# Altium schematic sheet нижняя плата версия 4.SchDoc
size 594 x 420 mm; Author: ALTIUM GOSTBOM2.0 KEV; SheetNumber: 1; SheetTotal: 1; Обозначение_Код: НАПК0001.00.02Р; Наименование2: Модуль питания; п_Разраб_Р: Хейфец С.С.; п_Пров_Р: Хрущев А.С.; п_Утв_Р: Хейфец С.С.; Вид_документа_SCH: Схема принципиальная; Наименование_организации: Неясыти Аэро
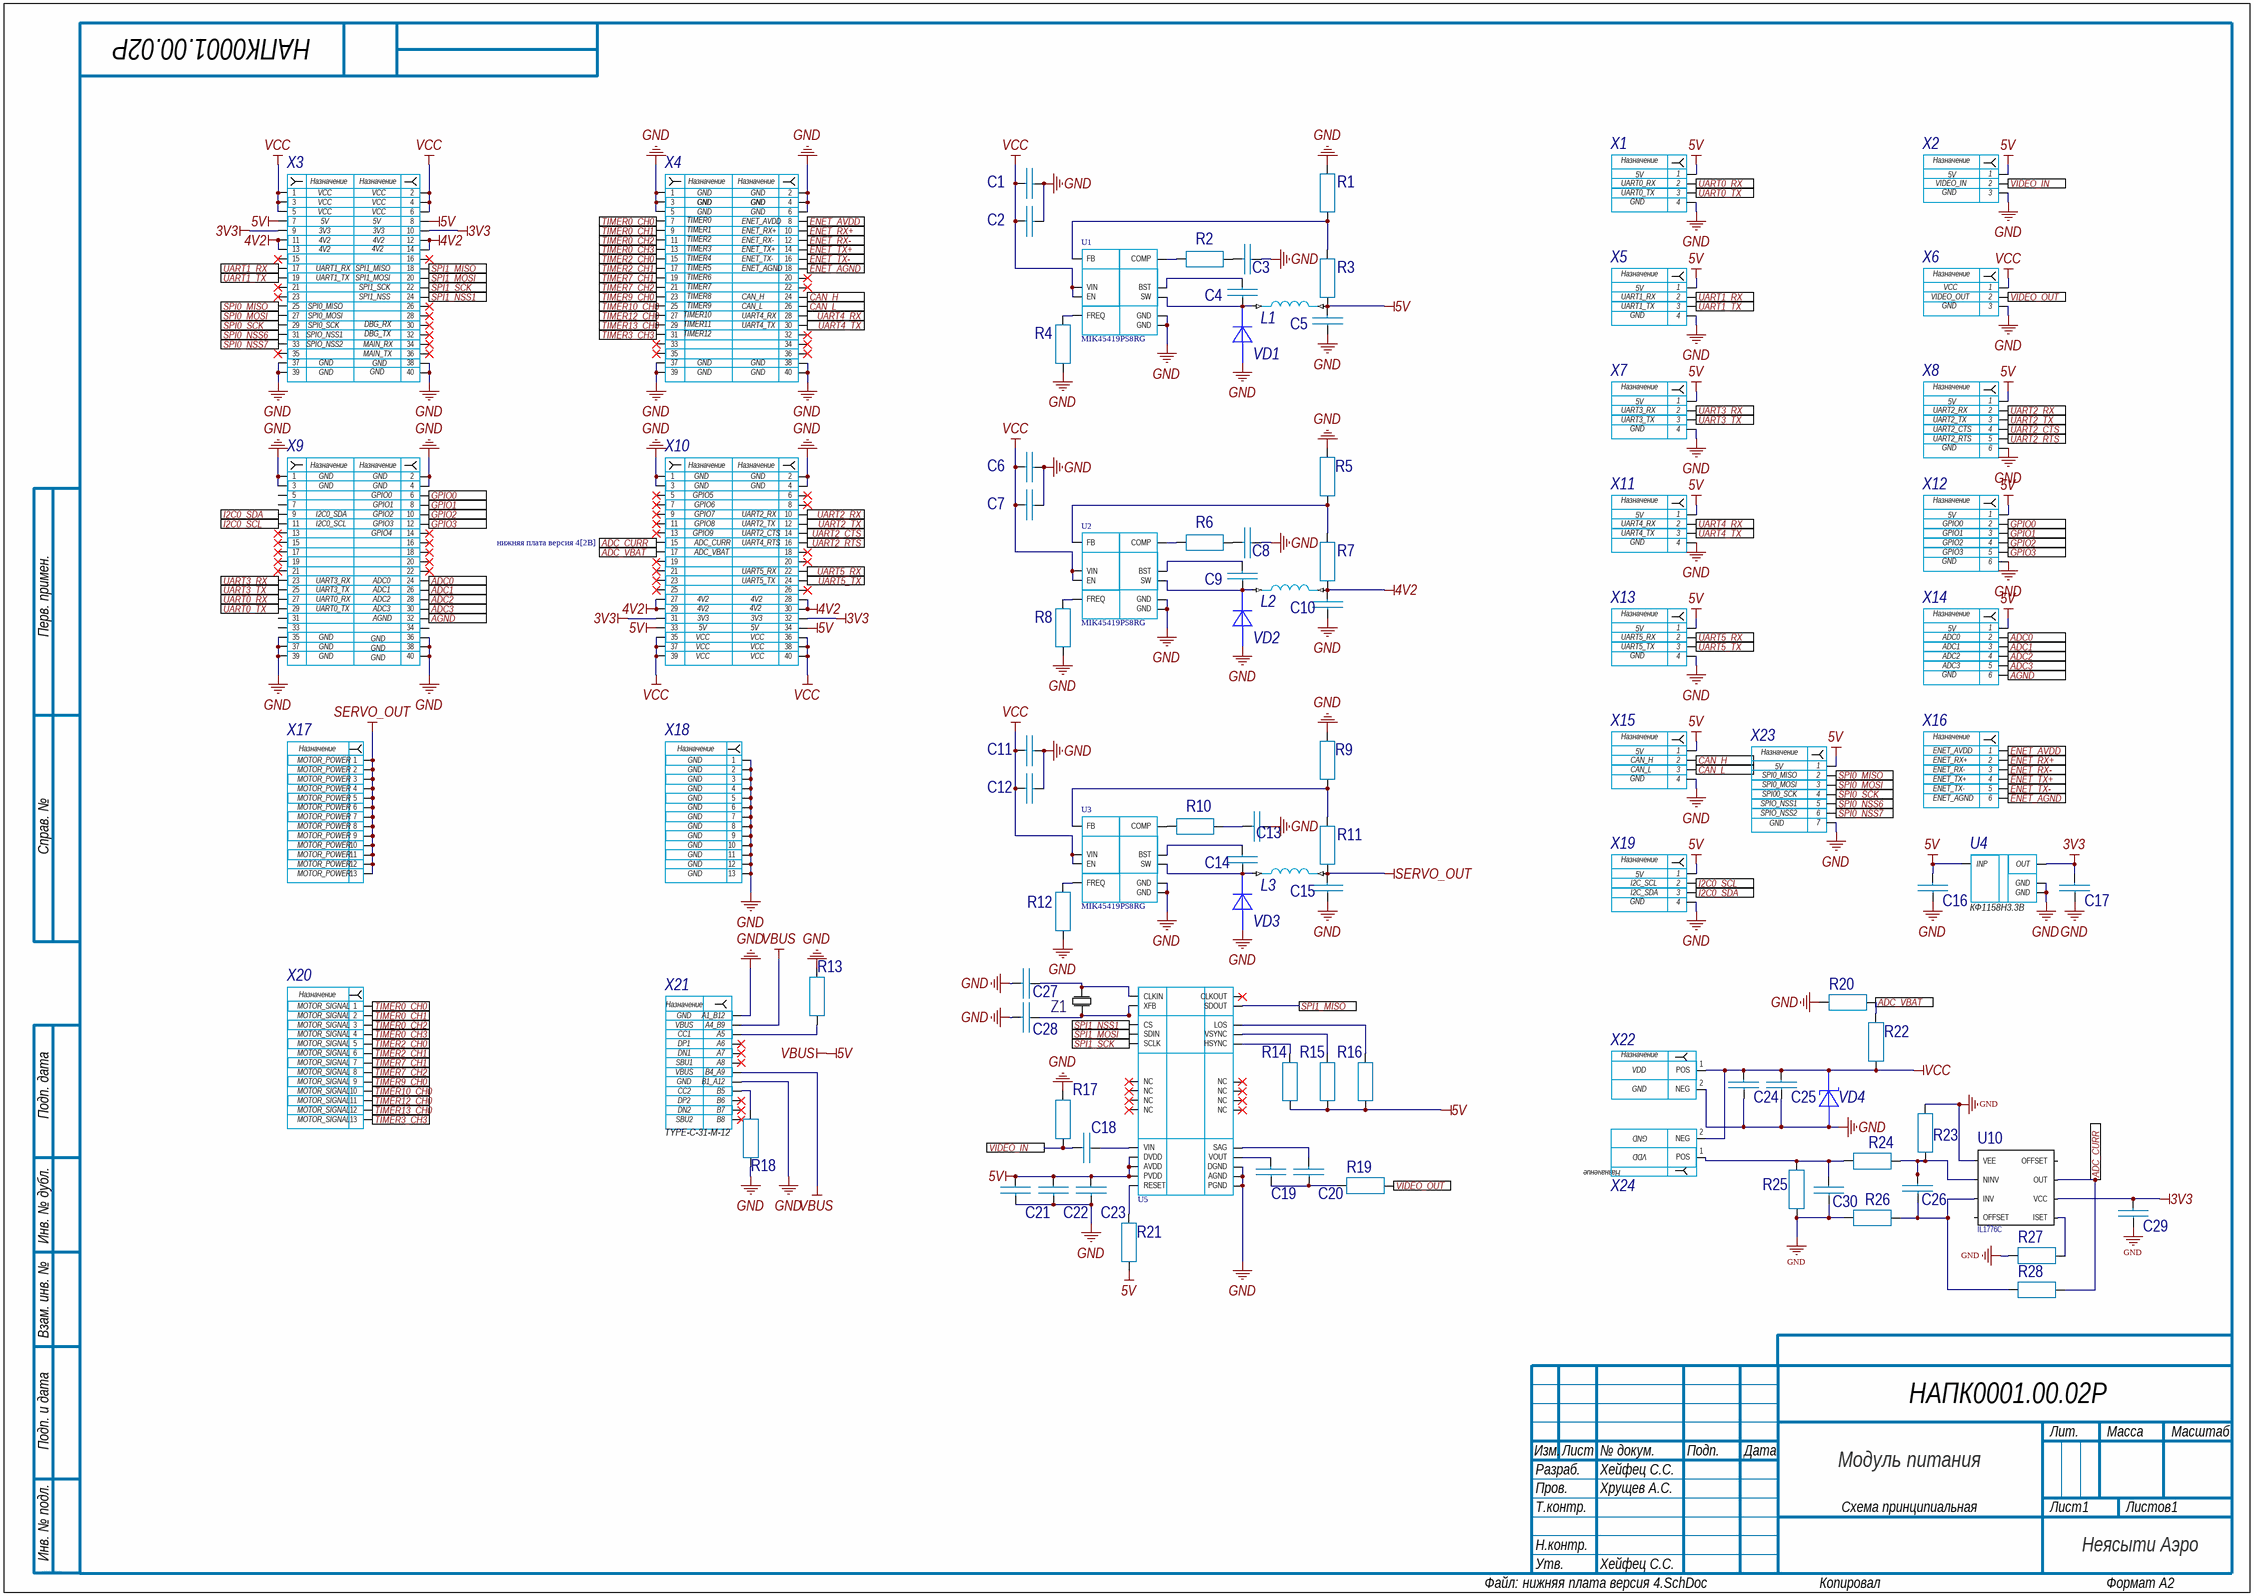
[diagram p0: нижняя плата версия 4.SchDoc]

## Parts
C1  4u7  [C1206]  (value not drawn)
C2  100n  [C0603]  (value not drawn)
C3  220p  [C0603]  (value not drawn)
C4  100n  [C0603]  (value not drawn)
C5  22u  [C0603]  (value not drawn)
C6  4u7  [C1206]  (value not drawn)
C7  100n  [C0603]  (value not drawn)
C8  220p  [C0603]  (value not drawn)
C9  100n  [C0603]  (value not drawn)
C10  22u  [C0603]  (value not drawn)
C11  4u7  [C1206]  (value not drawn)
C12  100n  [C0603]  (value not drawn)
C13  220p  [C0603]  (value not drawn)
C14  100n  [C0603]  (value not drawn)
C15  22u  [C1206]  (value not drawn)
C16  (no value)  [C0603]
C17  (no value)  [C0603]
C18  (no value)  [C0603]
C19  22u  [C1206]  (value not drawn)
C20  22u  [C1206]  (value not drawn)
C21  100n  [C0603]  (value not drawn)
C22  100n  [C0603]  (value not drawn)
C23  100n  [C0603]  (value not drawn)
C24  22u  [C1206]  (value not drawn)
C25  22u  [C1206]  (value not drawn)
C26  100n  [C0603]  (value not drawn)
C27  100n  [C0603]  (value not drawn)
C28  100n  [C0603]  (value not drawn)
C29  22u  [C1206]  (value not drawn)
C30  100n  [C0603]  (value not drawn)
L1  4u7  [МИ-3]  (value not drawn)
L2  4u7  [МИ-3]  (value not drawn)
L3  4u7  [МИ-3]  (value not drawn)
R1  23K7  [R0603]  (value not drawn)
R2  133K  [R0603]  (value not drawn)
R3  124K  [R0603]  (value not drawn)
R4  57K6  [R0603]  (value not drawn)
R5  29K4  [R0603]  (value not drawn)
R6  113K  [R0603]  (value not drawn)
R7  124K  [R0603]  (value not drawn)
R8  57.6  [R0603]  (value not drawn)
R9  23K7  [R0603]  (value not drawn)
R10  113K  [R0603]  (value not drawn)
R11  124K  [R0603]  (value not drawn)
R12  57.6  [R0603]  (value not drawn)
R13  (no value)  [R0603]
R14  1K  [R0603]  (value not drawn)
R15  1K  [R0603]  (value not drawn)
R16  1K  [R0603]  (value not drawn)
R17  75  [R0603]  (value not drawn)
R18  (no value)  [R0603]
R19  75  [R0603]  (value not drawn)
R20  10K  [R0603]  (value not drawn)
R21  10K  [R0603]  (value not drawn)
R22  100K  [R0603]  (value not drawn)
R23  1K  [R0603]  (value not drawn)
R24  1K  [R0603]  (value not drawn)
R25  0R001  [RESC6864X114N]  (value not drawn)
R26  1K  [R0603]  (value not drawn)
R27  1K  [R0603]  (value not drawn)
R28  1K  [R0603]  (value not drawn)
U1  MIK45419PS8RG  [SOIC127P600X170-9N]
U2  MIK45419PS8RG  [SOIC127P600X170-9N]
U3  MIK45419PS8RG  [SOIC127P600X170-9N]
U4  КФ1158Н3.3В  [SOT-428]
U5  AT7456  [at7456]  (value not drawn)
U10  IL1776C  [SOIC-8]
VD1  SS3P4  [DO-214AC]  (value not drawn)
VD2  SS3P4  [DO-214AC]  (value not drawn)
VD3  SS3P4  [DO-214AC]  (value not drawn)
VD4  (no value)  [DO-214AA]
X1  Molex Picoblade 0532610471  [PicoBlade 4pin]  (value not drawn)
X2  Molex Picoblade 0532610371  [PicoBlade 3pin]  (value not drawn)
X3  PLLD-1.27-40S  [Headr 2x20 male]  (value not drawn)
X4  PLLD-1.27-40S  [Headr 2x20 male]  (value not drawn)
X5  Molex Picoblade 0532610471  [PicoBlade 4pin]  (value not drawn)
X6  Molex Picoblade 0532610371  [PicoBlade 3pin]  (value not drawn)
X7  Molex Picoblade 0532610471  [PicoBlade 4pin]  (value not drawn)
X8  Molex Picoblade 0532610671  [PicoBlade 6pin]  (value not drawn)
X9  PLLD-1.27-40S  [Headr 2x20 male]  (value not drawn)
X10  PLLD-1.27-40S  [Headr 2x20 male]  (value not drawn)
X11  Molex Picoblade 0532610471  [PicoBlade 4pin]  (value not drawn)
X12  Molex Picoblade 0532610671  [PicoBlade 6pin]  (value not drawn)
X13  Molex Picoblade 0532610471  [PicoBlade 4pin]  (value not drawn)
X14  Molex Picoblade 0532610671  [PicoBlade 6pin]  (value not drawn)
X15  Molex Picoblade 0532610471  [PicoBlade 4pin]  (value not drawn)
X16  Molex Picoblade 0532610671  [PicoBlade 6pin]  (value not drawn)
X17  (no value)  [SERV]
X18  (no value)  [SERV]
X19  Molex Picoblade 0532610471  [PicoBlade 4pin]  (value not drawn)
X20  (no value)  [SERV]
X21  TYPE-C-31-M-12  [HRO_TYPE-C-31-M-12]
X22  Amass XT-60-PW-M  [AMASS_XT60PW-M]  (value not drawn)
X23  Molex Picoblade 0532610771  [PicoBlade 7pin]  (value not drawn)
X24  Amass XT-60-PW-F  [AMASS_XT60PW-F]  (value not drawn)
Z1  27MHz  [XTAL_NX5032GA-8.000M-STD-CSU-1]  (value not drawn)

## Ports
ADC0 (see нижняя плата версия 4[1A]), ADC0 (see нижняя плата версия 4[2A]), ADC1 (see нижняя плата версия 4[1A]), ADC1 (see нижняя плата версия 4[2A]), ADC2 (see нижняя плата версия 4[1A]), ADC2 (see нижняя плата версия 4[2A]), ADC3 (see нижняя плата версия 4[1A]), ADC3 (see нижняя плата версия 4[2A]), ADC_CURR (see нижняя плата версия 4[1A]), ADC_CURR (see нижняя плата версия 4[2B]), ADC_VBAT (see нижняя плата версия 4[1A]), ADC_VBAT (see нижняя плата версия 4[2B]), AGND (see нижняя плата версия 4[1A]), AGND (see нижняя плата версия 4[2A]), CAN_H (see нижняя плата версия 4[1A]), CAN_H (see нижняя плата версия 4[2A]), CAN_L (see нижняя плата версия 4[1A]), CAN_L (see нижняя плата версия 4[2A]), ENET_AGND (see нижняя плата версия 4[1A]), ENET_AGND (see нижняя плата версия 4[2A]), ENET_AVDD (see нижняя плата версия 4[1A]), ENET_AVDD (see нижняя плата версия 4[2A]), ENET_RX+ (see нижняя плата версия 4[1A]), ENET_RX+ (see нижняя плата версия 4[2A]), ENET_RX- (see нижняя плата версия 4[1A]), ENET_RX- (see нижняя плата версия 4[2A]), ENET_TX+ (see нижняя плата версия 4[1A]), ENET_TX+ (see нижняя плата версия 4[2A]), ENET_TX- (see нижняя плата версия 4[1A]), ENET_TX- (see нижняя плата версия 4[2A]), GPIO0 (see нижняя плата версия 4[1A]), GPIO0 (see нижняя плата версия 4[2A]), GPIO1 (see нижняя плата версия 4[1A]), GPIO1 (see нижняя плата версия 4[2A]), GPIO2 (see нижняя плата версия 4[1A]), GPIO2 (see нижняя плата версия 4[2A]), GPIO3 (see нижняя плата версия 4[1A]), GPIO3 (see нижняя плата версия 4[2A]), I2C0_SCL (see нижняя плата версия 4[1A]), I2C0_SCL (see нижняя плата версия 4[2B]), I2C0_SDA (see нижняя плата версия 4[1A]), I2C0_SDA (see нижняя плата версия 4[2B]), SPI0_MISO (see нижняя плата версия 4[1A]), SPI0_MISO (see нижняя плата версия 4[2A]), SPI0_MOSI (see нижняя плата версия 4[1A]), SPI0_MOSI (see нижняя плата версия 4[2A]), SPI0_NSS6 (see нижняя плата версия 4[1A]), SPI0_NSS6 (see нижняя плата версия 4[2B]), SPI0_NSS7 (see нижняя плата версия 4[1A]), SPI0_NSS7 (see нижняя плата версия 4[2B]), SPI0_SCK (see нижняя плата версия 4[1A]), SPI0_SCK (see нижняя плата версия 4[2A]), SPI1_MISO (see нижняя плата версия 4[1A]), SPI1_MISO (see нижняя плата версия 4[2B]), SPI1_MOSI (see нижняя плата версия 4[1A]), SPI1_MOSI (see нижняя плата версия 4[1B]), SPI1_NSS1 (see нижняя плата версия 4[1A]), SPI1_NSS1 (see нижняя плата версия 4[1B]), SPI1_SCK (see нижняя плата версия 4[1A]), SPI1_SCK (see нижняя плата версия 4[1B]), TIMER0_CH0 (see нижняя плата версия 4[1A]), TIMER0_CH0 (see нижняя плата версия 4[1B]), TIMER0_CH1 (see нижняя плата версия 4[1A]), TIMER0_CH1 (see нижняя плата версия 4[1B]), TIMER0_CH2 (see нижняя плата версия 4[1A]), TIMER0_CH2 (see нижняя плата версия 4[1B]), TIMER0_CH3 (see нижняя плата версия 4[1A]), TIMER0_CH3 (see нижняя плата версия 4[1B]), TIMER2_CH0 (see нижняя плата версия 4[1A]), TIMER2_CH0 (see нижняя плата версия 4[1B]), TIMER2_CH1 (see нижняя плата версия 4[1A]), TIMER2_CH1 (see нижняя плата версия 4[1B]), TIMER3_CH3 (see нижняя плата версия 4[1A]), TIMER3_CH3 (see нижняя плата версия 4[1B]), TIMER7_CH1 (see нижняя плата версия 4[1A]), TIMER7_CH1 (see нижняя плата версия 4[1B]), TIMER7_CH2 (see нижняя плата версия 4[1A]), TIMER7_CH2 (see нижняя плата версия 4[1B]), TIMER9_CH0 (see нижняя плата версия 4[1A]), TIMER9_CH0 (see нижняя плата версия 4[1B]), TIMER10_CH0 (see нижняя плата версия 4[1A]), TIMER10_CH0 (see нижняя плата версия 4[1B]), TIMER12_CH0 (see нижняя плата версия 4[1A]), TIMER12_CH0 (see нижняя плата версия 4[1B]), TIMER13_CH0 (see нижняя плата версия 4[1A]), TIMER13_CH0 (see нижняя плата версия 4[1B]), UART0_RX (see нижняя плата версия 4[1A]), UART0_RX (see нижняя плата версия 4[2A]), UART0_TX (see нижняя плата версия 4[1A]), UART0_TX (see нижняя плата версия 4[2A]), UART1_RX (see нижняя плата версия 4[1A]), UART1_RX (see нижняя плата версия 4[2A]), UART1_TX (see нижняя плата версия 4[1A]), UART1_TX (see нижняя плата версия 4[2A]), UART2_CTS (see нижняя плата версия 4[1A]), UART2_CTS (see нижняя плата версия 4[2A]), UART2_RTS (see нижняя плата версия 4[1A]), UART2_RTS (see нижняя плата версия 4[2A]), UART2_RX (see нижняя плата версия 4[1A]), UART2_RX (see нижняя плата версия 4[2A]), UART2_TX (see нижняя плата версия 4[1A]), UART2_TX (see нижняя плата версия 4[2A]), UART3_RX (see нижняя плата версия 4[1A]), UART3_RX (see нижняя плата версия 4[2A]), UART3_TX (see нижняя плата версия 4[1A]), UART3_TX (see нижняя плата версия 4[2A]), UART4_RX (see нижняя плата версия 4[1A]), UART4_RX (see нижняя плата версия 4[2A]), UART4_TX (see нижняя плата версия 4[1A]), UART4_TX (see нижняя плата версия 4[2A]), UART5_RX (see нижняя плата версия 4[1A]), UART5_RX (see нижняя плата версия 4[2A]), UART5_TX (see нижняя плата версия 4[1A]), UART5_TX (see нижняя плата версия 4[2A]), VIDEO_IN (see нижняя плата версия 4[1B]), VIDEO_IN (see нижняя плата версия 4[2A]), VIDEO_OUT (see нижняя плата версия 4[2A]), VIDEO_OUT (see нижняя плата версия 4[2B])

## Nets
3V3: C17.2 C29.2 U4.3(OUT) U10.7(VCC) X3.9 X3.10 X10.31 X10.32
4V2: C10.2 L2.2 R7.1 X3.11 X3.12 X3.13 X3.14 X10.27 X10.28 X10.29 X10.30
5V: C5.2 C16.2 C21.1 C22.1 C23.1 L1.2 R3.1 R14.1 R15.1 R16.1 R21.2 U4.1(INP) U5.3(DVDD) U5.21(AVDD) U5.24(PVDD) X1.1 X2.1 X3.7 X3.8 X5.1 X7.1 X8.1 X10.33 X10.34 X11.1 X12.1 X13.1 X14.1 X15.1 X19.1 X21.A4_B9 X21.B4_A9 X23.1  [also labelled VBUS]
GND: C1.1 C2.1 C3.2 C5.1 C6.1 C7.1 C8.2 C10.1 C11.1 C12.1 C13.2 C15.1 C16.1 C17.1 C21.2 C22.2 C23.2 C24.1 C25.1 C27.1 C28.1 C29.1 C30.2 R1.2 R4.1 R5.2 R8.1 R9.2 R12.1 R13.2 R17.1 R18.2 R20.2 R23.1 R25.1 R26.2 R27.2 U1.4(GND) U1.9(GND) U2.4(GND) U2.9(GND) U3.4(GND) U3.9(GND) U4.2(GND) U4.4(GND) U5.4(DGND) U5.20(AGND) U5.23(PGND) U10.4(VEE) VD1.1(А) VD2.1(А) VD3.1(А) VD4.1(А) X1.4 X2.3 X3.37 X3.38 X3.39 X3.40 X4.1 X4.2 X4.3 X4.4 X4.5 X4.6 X4.37 X4.38 X4.39 X4.40 X5.4 X6.3 X7.4 X8.6 X9.1 X9.2 X9.3 X9.4 X9.35 X9.36 X9.37 X9.38 X9.39 X9.40 X10.1 X10.2 X10.3 X10.4 X11.4 X12.6 X13.4 X15.4 X18.1 X18.2 X18.3 X18.4 X18.5 X18.6 X18.7 X18.8 X18.9 X18.10 X18.11 X18.12 X18.13 X19.4 X21.A1_B12 X21.B1_A12 X22.2(NEG) X23.7
SERVO_OUT: C15.2 L3.2 R11.1 X17.1 X17.2 X17.3 X17.4 X17.5 X17.6 X17.7 X17.8 X17.9 X17.10 X17.11 X17.12 X17.13
VCC: C1.2 C2.2 C6.2 C7.2 C11.2 C12.2 C24.2 C25.2 R22.1 U1.2(VIN) U1.5(EN) U2.2(VIN) U2.5(EN) U3.2(VIN) U3.5(EN) VD4.2(К) X3.1 X3.2 X3.3 X3.4 X3.5 X3.6 X6.1 X10.35 X10.36 X10.37 X10.38 X10.39 X10.40 X22.1(POS) X24.2(NEG)
ADC0: X9.24 X14.2 ; port ADC0
ADC1: X9.26 X14.3 ; port ADC1
ADC2: X9.28 X14.4 ; port ADC2
ADC3: X9.30 X14.5 ; port ADC3
ADC_CURR: R28.2 U10.6(OUT) X10.15 ; port ADC_CURR
ADC_VBAT: R20.1 R22.2 X10.17 ; port ADC_VBAT
AGND: X9.32 X14.6 ; port AGND
CAN_H: X4.24 X15.2 ; port CAN_H
CAN_L: X4.26 X15.3 ; port CAN_L
ENET_AGND: X4.18 X16.6 ; port ENET_AGND
ENET_AVDD: X4.8 X16.1 ; port ENET_AVDD
ENET_RX+: X4.10 X16.2 ; port ENET_RX+
ENET_RX-: X4.12 X16.3 ; port ENET_RX-
ENET_TX+: X4.14 X16.4 ; port ENET_TX+
ENET_TX-: X4.16 X16.5 ; port ENET_TX-
GPIO0: X9.6 X12.2 ; port GPIO0
GPIO1: X9.8 X12.3 ; port GPIO1
GPIO2: X9.10 X12.4 ; port GPIO2
GPIO3: X9.12 X12.5 ; port GPIO3
I2C0_SCL: X9.11 X19.2 ; port I2C0_SCL
I2C0_SDA: X9.9 X19.3 ; port I2C0_SDA
SPI0_MISO: X3.25 X23.2 ; port SPI0_MISO
SPI0_MOSI: X3.27 X23.3 ; port SPI0_MOSI
SPI0_NSS6: X3.31 X23.5 ; port SPI0_NSS6
SPI0_NSS7: X3.33 X23.6 ; port SPI0_NSS7
SPI0_SCK: X3.29 X23.4 ; port SPI0_SCK
SPI1_MISO: U5.11(SDOUT) X3.18 ; port SPI1_MISO
SPI1_MOSI: U5.9(SDIN) X3.20 ; port SPI1_MOSI
SPI1_NSS1: U5.8(CS) X3.24 ; port SPI1_NSS1
SPI1_SCK: U5.10(SCLK) X3.22 ; port SPI1_SCK
TIMER0_CH0: X4.7 X20.1 ; port TIMER0_CH0
TIMER0_CH1: X4.9 X20.2 ; port TIMER0_CH1
TIMER0_CH2: X4.11 X20.3 ; port TIMER0_CH2
TIMER0_CH3: X4.13 X20.4 ; port TIMER0_CH3
TIMER2_CH0: X4.15 X20.5 ; port TIMER2_CH0
TIMER2_CH1: X4.17 X20.6 ; port TIMER2_CH1
TIMER3_CH3: X4.31 X20.13 ; port TIMER3_CH3
TIMER7_CH1: X4.19 X20.7 ; port TIMER7_CH1
TIMER7_CH2: X4.21 X20.8 ; port TIMER7_CH2
TIMER9_CH0: X4.23 X20.9 ; port TIMER9_CH0
TIMER10_CH0: X4.25 X20.10 ; port TIMER10_CH0
TIMER12_CH0: X4.27 X20.11 ; port TIMER12_CH0
TIMER13_CH0: X4.29 X20.12 ; port TIMER13_CH0
UART0_RX: X1.2 X9.27 ; port UART0_RX
UART0_TX: X1.3 X9.29 ; port UART0_TX
UART1_RX: X3.17 X5.2 ; port UART1_RX
UART1_TX: X3.19 X5.3 ; port UART1_TX
UART2_CTS: X8.4 X10.14 ; port UART2_CTS
UART2_RTS: X8.5 X10.16 ; port UART2_RTS
UART2_RX: X8.2 X10.10 ; port UART2_RX
UART2_TX: X8.3 X10.12 ; port UART2_TX
UART3_RX: X7.2 X9.23 ; port UART3_RX
UART3_TX: X7.3 X9.25 ; port UART3_TX
UART4_RX: X4.28 X11.2 ; port UART4_RX
UART4_TX: X4.30 X11.3 ; port UART4_TX
UART5_RX: X10.22 X13.2 ; port UART5_RX
UART5_TX: X10.24 X13.3 ; port UART5_TX
VIDEO_IN: C18.1 R17.2 X2.2 ; port VIDEO_IN
VIDEO_OUT: R19.2 X6.2 ; port VIDEO_OUT
NetC3_1: C3.1 R2.2
NetC4_1: C4.1 L1.1 U1.3(SW) VD1.2(К)
NetC4_2: C4.2 U1.1(BST)
NetC8_1: C8.1 R6.2
NetC9_1: C9.1 L2.1 U2.3(SW) VD2.2(К)
NetC9_2: C9.2 U2.1(BST)
NetC13_1: C13.1 R10.2
NetC14_1: C14.1 L3.1 U3.3(SW) VD3.2(К)
NetC14_2: C14.2 U3.1(BST)
NetC18_2: C18.2 U5.22(VIN)
NetC19_1: C19.1 C20.1 R19.1
NetC19_2: C19.2 U5.26(VOUT)
NetC20_2: C20.2 U5.25(SAG)
NetC26_1: C26.1 R23.2 R24.1 U10.3(NINV)
NetC26_2: C26.2 R26.1 R28.1 U10.2(INV)
NetC27_2: C27.2 U5.5(CLKIN) Z1.2(X2)
NetC28_2: C28.2 U5.6(XFB) Z1.1(X1)
NetC30_1: C30.1 R24.2 R25.2 X24.1(POS)
NetR1_1: R1.1 R3.2 U1.6(FB)
NetR2_1: R2.1 U1.7(COMP)
NetR4_2: R4.2 U1.8(FREQ)
NetR5_1: R5.1 R7.2 U2.6(FB)
NetR6_1: R6.1 U2.7(COMP)
NetR8_2: R8.2 U2.8(FREQ)
NetR9_1: R9.1 R11.2 U3.6(FB)
NetR10_1: R10.1 U3.7(COMP)
NetR12_2: R12.2 U3.8(FREQ)
NetR13_1: R13.1 X21.A5
NetR14_2: R14.2 U5.18(HSYNC)
NetR15_2: R15.2 U5.17(VSYNC)
NetR16_2: R16.2 U5.12(LOS)
NetR18_1: R18.1 X21.B5
NetR21_1: R21.1 U5.19(RESET)
NetR27_1: R27.1 U10.8(ISET)

Not connected (* = marked no-connect by the designer): U5 1(NC)* 2(NC)* 7(CLKOUT)* 13(NC)* 14(NC)* 15(NC)* 16(NC)* 27(NC)* 28(NC)*; U10 1(OFFSET) 5(OFFSET); X3 15* 16* 21* 23* 26* 28* 30* 32* 34* 35* 36*; X4 20* 22* 32* 33* 34* 35* 36*; X9 5 7 13* 14* 15* 16* 17* 18* 19* 20* 21* 22* 31 33 34; X10 5* 6* 7* 8* 9* 11* 13* 18* 19* 20* 21* 23* 25* 26*; X21 A6* A7* A8* B6* B7* B8*

## Notes on the sheet
- 5V
- (near X3) VCC
- (near X3) 5V
- (near X4) TIMER0
- (near X4) GND
- (near X4) ENET_AVDD
- (near X1) UART0_RX
- (near X1) UART0_TX
- GND
- (near X2) VIDEO_IN
- (near X3) UART1_RX
- (near X3) 3V3
- (near X3) 4V2
- (near X3) SPI1_MISO
- (near X4) TIMER1
- (near X4) TIMER2
- (near X4) TIMER3
- (near X4) TIMER4
- (near X4) TIMER5
- (near X4) ENET_RX+
- (near X4) ENET_RX-
- (near X4) ENET_TX+
- (near X4) ENET_TX-
- (near X4) ENET_AGND
- (near X3) UART1_TX
- (near X3) SPI0_MISO
- (near X3) SPI0_MOSI
- (near X3) SPI1_MOSI
- (near X3) SPI1_SCK
- (near X3) SPI1_NSS
- (near X4) TIMER6
- (near X4) TIMER7
- (near X4) TIMER8
- (near X4) TIMER9
- (near X4) TIMER10
- (near X4) CAN_H
- (near X4) CAN_L
- (near X4) UART4_RX
- (near X5) UART1_TX
- (near X5) UART1_RX
- VCC
- (near X6) VIDEO_OUT
- (near X3) GND
- (near X3) SPI0_SCK
- (near X3) SPIO_NSS1
- (near X3) SPIO_NSS2
- (near X3) MAIN_RX
- (near X3) MAIN_TX
- (near X3) DBG_RX
- (near X3) DBG_TX
- (near X4) TIMER11
- (near X4) TIMER12
- (near X4) UART4_TX
- (near X7) UART3_RX
- (near X8) UART2_RX
- (near X7) UART3_TX
- (near X8) UART2_TX
- (near X8) UART2_CTS
- (near X8) UART2_RTS
- (near X9) GND
- (near X9) GPIO1
- (near X9) GPIO0
- (near X10) GPIO6
- (near X10) GND
- (near X10) GPIO5
- (near X9) I2C0_SDA
- (near X9) I2C0_SCL
- (near X9) GPIO2
- (near X9) GPIO3
- (near X9) GPIO4
- (near X10) GPIO7
- (near X10) GPIO8
- (near X10) ADC_CURR
- (near X10) ADC_VBAT
- (near X10) GPIO9
- (near X10) UART2_RX
- (near X10) UART2_TX
- (near X10) UART2_CTS
- (near X10) UART4_RTS
- (near X11) UART4_TX
- (near X11) UART4_RX
- (near X12) GPIO3
- (near X12) GPIO2
- (near X12) GPIO1
- (near X12) GPIO0
- (near X9) UART3_RX
- (near X9) UART3_TX
- (near X9) UART0_RX
- (near X9) ADC0
- (near X9) ADC1
- (near X9) ADC2
- (near X10) 4V2
- (near X10) UART5_RX
- (near X10) UART5_TX
- (near X9) UART0_TX
- (near X9) ADC3
- (near X9) AGND
- (near X10) VCC
- (near X10) 5V
- (near X10) 3V3
- (near X13) UART5_TX
- (near X13) UART5_RX
- ADC1
- ADC0
- ADC3
- ADC2
- (near X16) ENET_AVDD
- (near X17) MOTOR_POWER
- (near X18) GND
- (near X15) CAN_L
- (near X15) CAN_H
- (near X23) SPI0_MISO
- (near X23) SPI0_MOSI
- (near X23) SPI00_SCK
- (near X16) ENET_RX+
- (near X16) ENET_RX-
- (near X16) ENET_TX+
- (near X16) ENET_TX-
- (near X16) ENET_AGND
- (near X23) SPIO_NSS1
- (near X23) SPIO_NSS2
- (near X19) I2C_SDA
- (near X19) I2C_SCL
- (near X20) MOTOR_SIGNAL
- Перв. примен.
- Справ. №
- Подп. дата
- Инв. № дубл.
- Взам. инв. №
- Подп. и дата
- Изм.
- Разраб.
- Лист
- № докум.
- Подп.
- Дата
- Лит.
- Масса
- Масштаб
- Пров.
- Т.контр.
- Листов
- Инв. № подл.
- Н.контр.
- Утв.
- ALTIUM GOSTBOM2.0 KEV
- Файл:
- Копировал
- Формат А2
- (in symbol Header 1x3) Назначение
- (in symbol Header 1x4) Назначение
- (in symbol Header 1x6) Назначение
- (in symbol Header 1x7) Назначение
- (in symbol Header 2x20) Назначение
- (in symbol SERVO) Назначение
- (in symbol TYPE-C-31-M-12) Назначение; GND; VBUS; CC1; DP1; DN1; SBU1; CC2; DP2; DN2; SBU2
- (in symbol XT60PW-M) Назначение; VDD; GND

## Library data of the parts
C1-C30 = C1_POSTOYANNYJ: Конденсатор постоянной емкости
  C1 C6 C11: Value: 4u7
  C2 C4 C7 C9 C12 C14 C21-C23 C26-C28 C30: Value: 100n
  C3 C8 C13: Value: 220p
  C5 C10 C15 C19 C20 C24 C25 C29: Value: 22u
L1-L3 = Inductor: Описание свойств компонента; Value: 4u7
R1-R28 = R1_POSTOYANNYJ: Резистор постоянный
  R1 R9: Value: 23K7
  R2: Value: 133K
  R3 R7 R11: Value: 124K
  R4: Value: 57K6
  R5: Value: 29K4
  R6 R10: Value: 113K
  R8 R12: Value: 57.6
  R14-R16 R23 R24 R26-R28: Value: 1K
  R17 R19: Value: 75
  R20 R21: Value: 10K
  R22: Value: 100K
  R25: Value: 0R001
U1-U3 = MP1584EN: DC-DC; Value: MP1584EN
U4 = КФ1158Н: LDO; Value: КФ1158Н3.3В
U5 = AT7456: OSD; Value: AT7456
VD1-VD3 = Diode: Type: Диод; Published: 18.05.2010; Publisher: Andrew Danich; Value: SS3P4
VD4 = Schottky: Type: Диод; Published: 18.05.2010; Publisher: Andrew Danich
X1 X5 X7 X11 X13 X15 X19 = Header 1x4: Value: Molex Picoblade 0532610471
X2 X6 = Header 1x3: Value: Molex Picoblade 0532610371
X3 X4 X9 X10 = Header 2x20: Value: PLLD-1.27-40S
X8 X12 X14 X16 = Header 1x6: Value: Molex Picoblade 0532610671
X17 X18 X20 = SERVO
X22 X24 = XT60PW-M
  X22: Value: Amass XT-60-PW-M
  X24: Value: Amass XT-60-PW-F
X23 = Header 1x7: Value: Molex Picoblade 0532610771
Z1 = KX-38T: Value: 27MHz
X21 = TYPE-C-31-M-12: Value: TYPE-C-31-M-12